# Altium schematic sheet MicroMultimeter_USB_Sch.SchDoc: MicroMultimeter - USB
size 127 x 101 mm; Author: Hom; CompanyName: KitSprout; DrawnBy: Hom; Engineer: Hom; Organization: KitSprout; Revision: A; SheetNumber: 1; SheetTotal: 1; License: CC BY-SA 4.0; Version: 1.0; LibVersion: 1.4; PageSetup: Record=PageOptions|CenterHorizontal=True|CenterVertical=True|PrintScale=1.00|XCorrection=1.00|YCorrection=1.00|PrintKind=0|BorderSize=5000000|LeftOffset=0|BottomOffset=0|Orientation=2|PaperLength=1000|PaperWidth=1000|Scale=100|PaperSource=7|PrintQuality=-3|MediaType=1|DitherType=10|PrintScaleMode=0|PaperKind=A4|PaperIndex=9
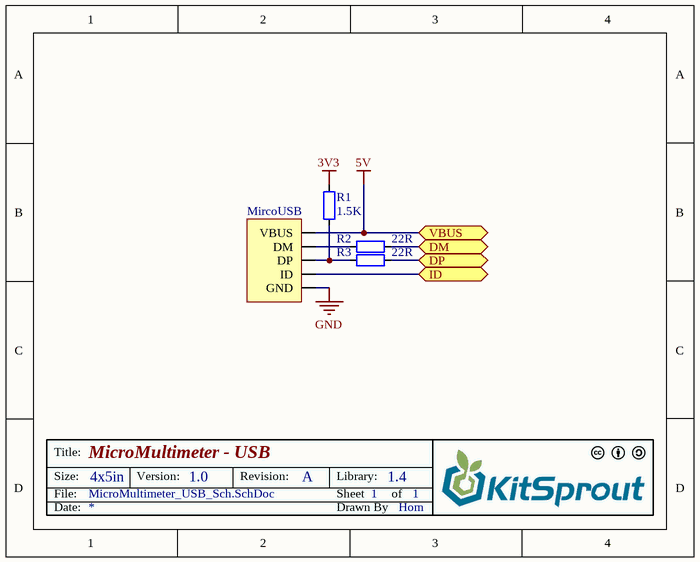
[diagram p0: MicroMultimeter_USB_Sch.SchDoc]

## Parts
MircoUSB  USB_Micro  [USB_Micro-AB]  (value not drawn)
R1  value 1.5K  [RES_0603]  (hidden comment: Res_0603)
R2  value 22R  [RES_0603]  (hidden comment: Res_0603)
R3  value 22R  [RES_0603]  (hidden comment: Res_0603)

## Ports
DM, DP, ID, VBUS

## Nets
3V3: R1.1
5V: MircoUSB.1(VBUS) ; port VBUS
GND: MircoUSB.5(GND)
DM: R2.2 ; port DM
DP: R3.2 ; port DP
ID: MircoUSB.4(ID) ; port ID
NetMircoUSB_2: MircoUSB.2(DM) R2.1
NetMircoUSB_3: MircoUSB.3(DP) R1.2 R3.1

## Notes on the sheet
- Title:
- Size:
- Date:
- File:
- 4x5in
- Version:
- Revision:
- Sheet
- Drawn By
- Library:
- of

## Library data of the parts
MircoUSB = USB_Micro: USB
R1-R3 = Res_0603: Resistor